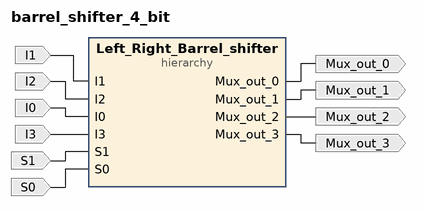
[diagram p0: block diagram of the top level]
# Vivado block design barrel_shifter_4_bit, xc7z010clg400-1, Vivado 2019.1
create_bd_design barrel_shifter_4_bit

create_bd_port -dir I I0
create_bd_port -dir I I1
create_bd_port -dir I I2
create_bd_port -dir I I3
create_bd_port -dir I S1
create_bd_port -dir I S0
create_bd_port -dir O Mux_out_0
create_bd_port -dir O Mux_out_1
create_bd_port -dir O Mux_out_2
create_bd_port -dir O Mux_out_3

create_bd_cell -type hier Left_Right_Barrel_shifter

# ---- hierarchy /Left_Right_Barrel_shifter ----
current_bd_instance /Left_Right_Barrel_shifter
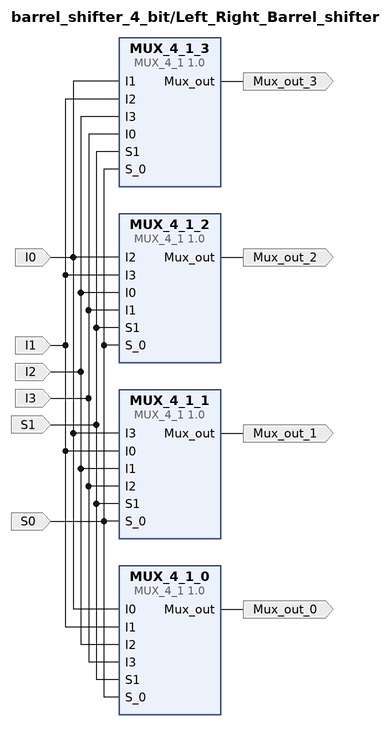
[diagram p1: block diagram inside /Left_Right_Barrel_shifter]
create_bd_pin -dir I I0
create_bd_pin -dir I I1
create_bd_pin -dir I I2
create_bd_pin -dir I I3
create_bd_pin -dir O Mux_out_0
create_bd_pin -dir I S1
create_bd_pin -dir I S0
create_bd_pin -dir O Mux_out_1
create_bd_pin -dir O Mux_out_3
create_bd_pin -dir O Mux_out_2

create_bd_cell -type ip -vlnv xilinx.com:user:MUX_4_1:1.0 MUX_4_1_0
create_bd_cell -type ip -vlnv xilinx.com:user:MUX_4_1:1.0 MUX_4_1_1
create_bd_cell -type ip -vlnv xilinx.com:user:MUX_4_1:1.0 MUX_4_1_3
create_bd_cell -type ip -vlnv xilinx.com:user:MUX_4_1:1.0 MUX_4_1_2

# ---- connections ----

current_bd_instance /Left_Right_Barrel_shifter
connect_bd_net [get_bd_pins I0] [get_bd_pins MUX_4_1_3/I1] [get_bd_pins MUX_4_1_2/I2] [get_bd_pins MUX_4_1_1/I3] [get_bd_pins MUX_4_1_0/I0]
connect_bd_net [get_bd_pins I1] [get_bd_pins MUX_4_1_3/I2] [get_bd_pins MUX_4_1_2/I3] [get_bd_pins MUX_4_1_1/I0] [get_bd_pins MUX_4_1_0/I1]
connect_bd_net [get_bd_pins I2] [get_bd_pins MUX_4_1_3/I3] [get_bd_pins MUX_4_1_1/I1] [get_bd_pins MUX_4_1_2/I0] [get_bd_pins MUX_4_1_0/I2]
connect_bd_net [get_bd_pins I3] [get_bd_pins MUX_4_1_3/I0] [get_bd_pins MUX_4_1_2/I1] [get_bd_pins MUX_4_1_1/I2] [get_bd_pins MUX_4_1_0/I3]
connect_bd_net [get_bd_pins MUX_4_1_0/Mux_out] [get_bd_pins Mux_out_0]
connect_bd_net -net S1_0_1 [get_bd_pins S1] \
  [get_bd_pins MUX_4_1_1/S1] [get_bd_pins MUX_4_1_2/S1] [get_bd_pins MUX_4_1_3/S1] [get_bd_pins MUX_4_1_0/S1]
connect_bd_net -net S_0_0_1 [get_bd_pins S0] \
  [get_bd_pins MUX_4_1_1/S_0] [get_bd_pins MUX_4_1_2/S_0] [get_bd_pins MUX_4_1_3/S_0] [get_bd_pins MUX_4_1_0/S_0]
connect_bd_net [get_bd_pins MUX_4_1_1/Mux_out] [get_bd_pins Mux_out_1]
connect_bd_net [get_bd_pins MUX_4_1_3/Mux_out] [get_bd_pins Mux_out_3]
connect_bd_net [get_bd_pins MUX_4_1_2/Mux_out] [get_bd_pins Mux_out_2]

current_bd_instance /
connect_bd_net [get_bd_ports I1] [get_bd_pins Left_Right_Barrel_shifter/I1]
connect_bd_net [get_bd_ports I2] [get_bd_pins Left_Right_Barrel_shifter/I2]
connect_bd_net [get_bd_ports I0] [get_bd_pins Left_Right_Barrel_shifter/I0]
connect_bd_net [get_bd_ports I3] [get_bd_pins Left_Right_Barrel_shifter/I3]
connect_bd_net -net S1_0_1 [get_bd_ports S1] [get_bd_pins Left_Right_Barrel_shifter/S1]
connect_bd_net -net S_0_0_1 [get_bd_ports S0] [get_bd_pins Left_Right_Barrel_shifter/S0]
connect_bd_net -net MUX_4_1_0_Mux_out [get_bd_pins Left_Right_Barrel_shifter/Mux_out_0] [get_bd_ports Mux_out_0]
connect_bd_net -net MUX_4_1_1_Mux_out [get_bd_pins Left_Right_Barrel_shifter/Mux_out_1] [get_bd_ports Mux_out_1]
connect_bd_net -net MUX_4_1_2_Mux_out [get_bd_pins Left_Right_Barrel_shifter/Mux_out_2] [get_bd_ports Mux_out_2]
connect_bd_net -net MUX_4_1_3_Mux_out [get_bd_pins Left_Right_Barrel_shifter/Mux_out_3] [get_bd_ports Mux_out_3]

validate_bd_design
save_bd_design
